# Altium schematic sheet [09] - COMMUNICATION.SchDoc: X
size A4; Date: DD-MM-YYYY; CheckedBy: X; DrawnBy: Y; Revision: 0.0.0; SheetNumber: X; SheetTotal: Y; Projectnumber: OWN-000; Size: A4; Projectname: X
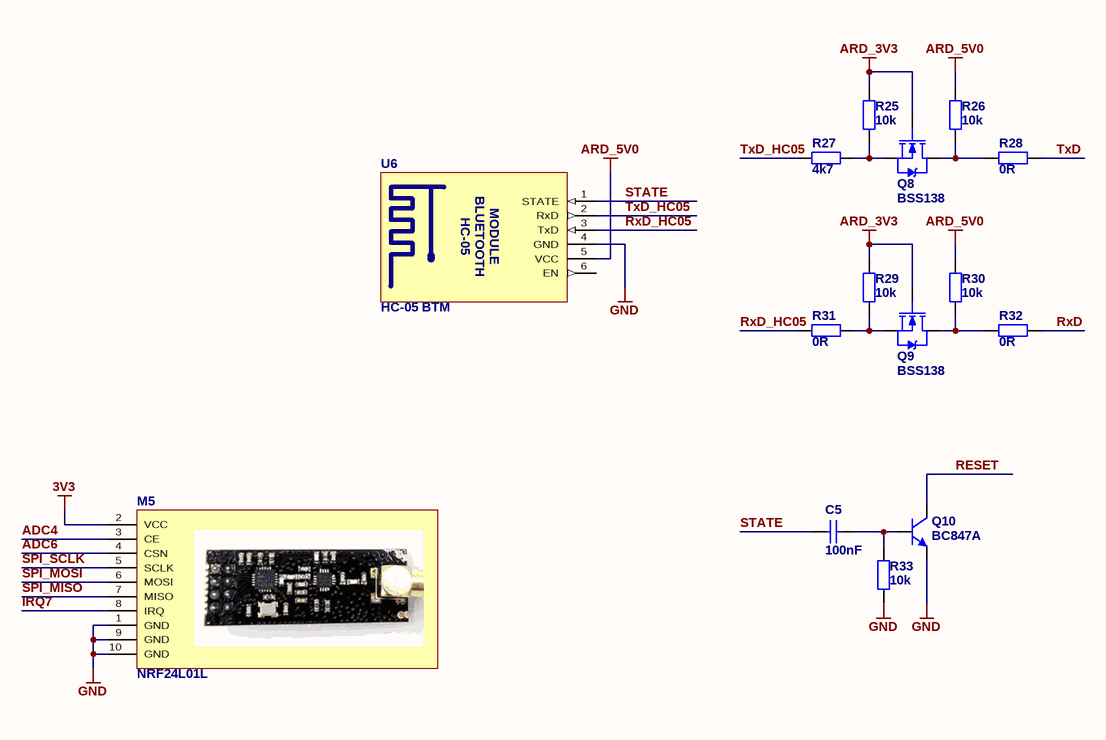
[diagram p0: [09] - COMMUNICATION.SchDoc]

## Parts
C5  100nF  [C0805]
M5  NRF24L01L  [NRF24L01L]
Q8  BSS138  [SOT-23]
Q9  BSS138  [SOT-23]
Q10  BC847A  [SOT-23]
R25  10k  [R0805]
R26  10k  [R0805]
R27  4k7  [R0805]
R28  0R  [R0805]
R29  10k  [R0805]
R30  10k  [R0805]
R31  0R  [R0805]
R32  0R  [R0805]
R33  10k  [R0805]
U6  HC-05 BTM  [HC-05_H]

## Nets
3V3: M5.2(VCC)
ARD_3V3: Q8.1(G) Q9.1(G) R25.1 R29.1
ARD_5V0: R26.1 R30.1 U6.5(VCC)
GND: M5.1(GND) M5.9(GND) M5.10(GND) Q10.2(E) R33.2 U6.4(GND)
ADC4: M5.3(CE)
ADC6: M5.4(CSN)
IRQ7: M5.8(IRQ)
RESET: Q10.3(C)
RxD: R32.2
RxD_HC05: R31.1 U6.3(TxD)
SPI_MISO: M5.7(MISO)
SPI_MOSI: M5.6(MOSI)
SPI_SCLK: M5.5(SCLK)
STATE: C5.1 U6.1(STATE)
TxD: R28.2
TxD_HC05: R27.1 U6.2(RxD)
NetC5_2: C5.2 Q10.1(B) R33.1
NetQ8_2: Q8.2(S) R25.2 R27.2
NetQ8_3: Q8.3(D) R26.2 R28.1
NetQ9_2: Q9.2(S) R29.2 R31.2
NetQ9_3: Q9.3(D) R30.2 R32.1

Not connected (* = marked no-connect by the designer): U6 6(EN)

## Notes on the sheet
- REV:
- A  P  P  R  O  V  E  D
- /
- Lodz University of Technology
- ul. Wolczanska 211/215
- 90-924 LODZ, POLAND
- Institute of Electronics
- Project name:
- Title:
- Author:
- Verified by:
- (in symbol HC-05_BTM) HC-05; BLUETOOTH; MODULE

## Library data of the parts
C5 = Cap: Capacitor; ComponentLink1Description: datasheet; ComponentLink2Description: supplier; Value: 100nF
M5 = NRF24L01L: Long Range Wireless Module R2 (1.1KM, PA+SMA)
Q8 Q9 = BSS138: N-Channel Enhancement Mode Vertical DMOS FET; Published: 17-Dec-2003; DatasheetVersion: Mar-96; PackageVersion: 1996; PackageReference: SOT23; Publisher: Altium Limited; PackageDescription: SOT-23; 3 Leads; Body 3.1 x 2.5 mm, inc. leads (LxW max), Alternate Lead Configuration; ComponentLink1Description: Manufacturer Link; ComponentLink1URL: http://www.zetex.com/; ComponentLink2Description: Datasheet; ComponentLink2URL: www.zetex.com/3.0/pdf/BSS138.pdf
Q10 = BC847A: NPN General Purpose Transistor (VCE=45V, IC=100mA, HFE=110-220); PowerRating: 250mW; VCEO: 45V; IC: 100mA; Supplier 1: TME; Supplier 2: Farnell; Supplier 3: Farnell; Supplier 4: Farnell; Supplier 5: Farnell; Supplier Part Number 1: BC847A-DIO; Supplier Part Number 2: 1081231; Supplier Part Number 3: 1081231RL; Supplier Part Number 4: 1459037RL; Supplier Part Number 5: 1459037; HFE: 110-220
R25-R33 = Res: Resistor; Published: 19-Feb-2006; ComponentLink1Description: datasheet; ComponentLink2Description: supplier
  R25 R26 R29 R30 R33: Value: 10k
  R27: Value: 4k7
  R28 R31 R32: Value: 0R
U6 = HC-05_BTM: HC-05 Bluetooth Module